# Altium schematic sheet CPLD.SchDoc
size A4; SheetNumber: 5; SheetTotal: 6
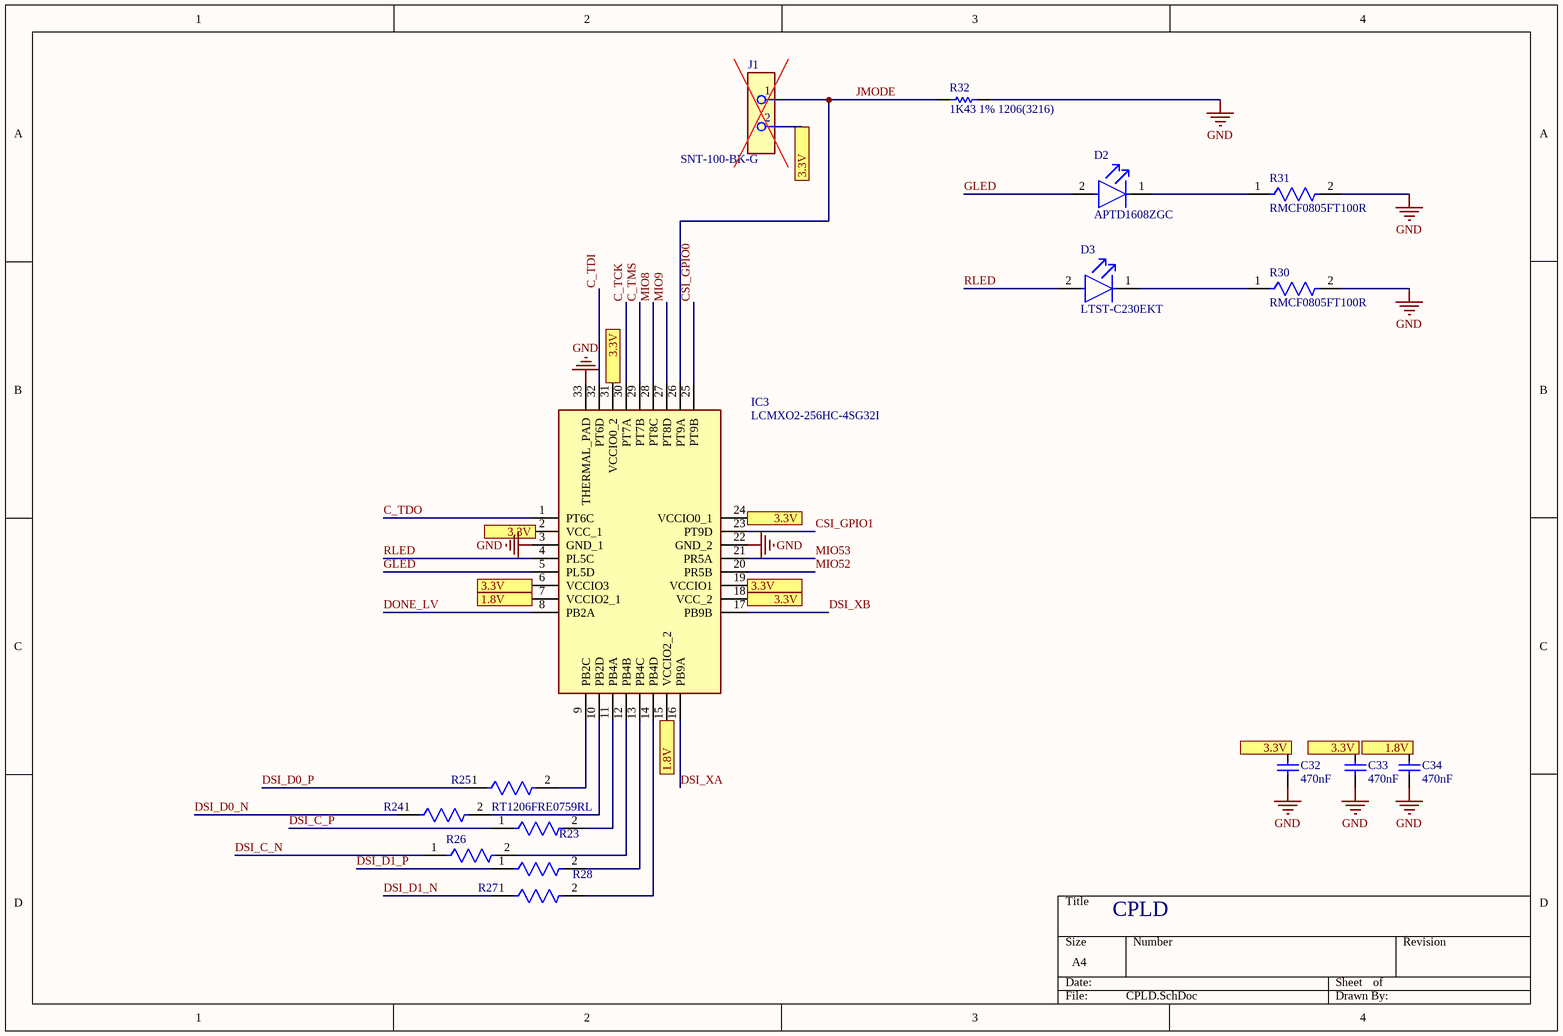
[diagram p0: CPLD.SchDoc]

## Parts
C32  470nF  [CAPC2013X140X50ML20T25]
C33  470nF  [CAPC2013X140X50ML20T25]
C34  470nF  [CAPC2013X140X50ML20T25]
D2  APTD1608ZGC  [FP-APTD1608ZGC-MFG]
D3  LTST-C230EKT  [FP-LTST-C230EKT-MFG]
IC3  LCMXO2-256HC-4SG32I  [QFN50P500X500X60-33N]
J1  SNT-100-BK-G  [FP-SNT-100-BK-G-MFG]  (no BOM)
R23  RT1206FRE0759RL  [FP-RT1206-MFG]  (value not drawn)
R24  RT1206FRE0759RL  [FP-RT1206-MFG]  (value not drawn)
R25  RT1206FRE0759RL  [FP-RT1206-MFG]
R26  RT1206FRE0759RL  [FP-RT1206-MFG]  (value not drawn)
R27  RT1206FRE0759RL  [FP-RT1206-MFG]  (value not drawn)
R28  RT1206FRE0759RL  [FP-RT1206-MFG]  (value not drawn)
R30  RMCF0805FT100R  [FP-RMCF0805-IPC_A]
R31  RMCF0805FT100R  [FP-RMCF0805-IPC_A]
R32  1K43 1% 1206(3216)  [RESC1206(3216)_M]

## Ports
1.8V (see CPLD[2C], CPLD[2D]), 1.8V (see CPLD[2C], CPLD[4C]), 1.8V (see CPLD[2D], CPLD[4C]), 3.3V (see connector1[2A], connector2[1B], connector2[3A], connector2[4A], connector2[4C], connector2[4D], connector2[5C], connector2[6B], connector2[6D], connector2[7B], CPLD[2B], CPLD[2C], CPLD[3A], CPLD[4C], ftdi[1B], ftdi[1C], ftdi[1D], ftdi[2B], ftdi[3C], ftdi[4B]), 3.3V (see connector1[2A], connector2[1B], connector2[3A], connector2[4A], connector2[4C], connector2[4D], connector2[5C], connector2[6B], connector2[6D], connector2[7B], CPLD[2B], CPLD[2C], CPLD[4C], ftdi[1B], ftdi[1C], ftdi[1D], ftdi[2B], ftdi[3C], ftdi[4B]), 3.3V (see connector1[2A], connector2[1B], connector2[3A], connector2[4A], connector2[4C], connector2[4D], connector2[5C], connector2[6B], connector2[6D], connector2[7B], CPLD[2C], CPLD[3A], CPLD[4C], ftdi[1B], ftdi[1C], ftdi[1D], ftdi[2B], ftdi[3C], ftdi[4B])

## Nets
GND: C32.1 C33.1 C34.1 IC3.3(GND_1) IC3.22(GND_2) IC3.33(THERMAL_PAD) R30.2 R31.2 R32.2
1.8V: IC3.7(VCCIO2_1) IC3.15(VCCIO2_2) ; port 1.8V
3.3V: IC3.6(VCCIO3) IC3.18(VCC_2) IC3.19(VCCIO1) IC3.24(VCCIO0_1) IC3.31(VCCIO0_2) ; port 3.3V
C_TCK: IC3.30(PT7A)
C_TDI: IC3.32(PT6D)
C_TDO: IC3.1(PT6C)
C_TMS: IC3.29(PT7B)
CSI_GPIO0: IC3.25(PT9B)
CSI_GPIO1: IC3.23(PT9D)
DONE_LV: IC3.8(PB2A)
DSI_C_N: R26.1
DSI_C_P: R23.1
DSI_D0_N: R24.1
DSI_D0_P: R25.1
DSI_D1_N: R27.1
DSI_D1_P: R28.1
DSI_XA: IC3.16(PB9A)
DSI_XB: IC3.17(PB9B)
GLED: D2.2(A) IC3.5(PL5D)
JMODE: IC3.26(PT9A) R32.1
MIO8: IC3.28(PT8C)
MIO9: IC3.27(PT8D)
MIO52: IC3.20(PR5B)
MIO53: IC3.21(PR5A)
RLED: D3.2(A) IC3.4(PL5C)
NetD2_1: D2.1(C) R31.1
NetD3_1: D3.1(C) R30.1
NetIC3_9: IC3.9(PB2C) R25.2
NetIC3_10: IC3.10(PB2D) R24.2
NetIC3_11: IC3.11(PB4A) R23.2
NetIC3_12: IC3.12(PB4B) R26.2
NetIC3_13: IC3.13(PB4C) R28.2
NetIC3_14: IC3.14(PB4D) R27.2

Not connected (* = marked no-connect by the designer): C32 2; C33 2; C34 2; IC3 2(VCC_1)

## Notes on the sheet
- CPLD

## Library data of the parts
C32-C34 = CMP-2007-04634-1: Manufacturer: AVX Interconnect / Elco; Part Number: 08055C474JAT2A
D2 = CMP-44529-000047-1: LED GREEN CLEAR CHIP SMD; Forward Current: 20mA; Viewing Angle: 60°; Dominant Wavelength: 525nm; Luminous Intensity: 780mcd; Forward Voltage: 3.3V; Lens Style: Clear; Max Operating Temperature: 85°C; Case/Package: 0603; Illumination Color: Green; Mount: Surface Mount; Case Code (Imperial): 0603; Case Code (Metric): 1608; Min Operating Temperature: -40°C; Length: 1.6mm; Color: Green; Lead Free: Lead Free; Width: 0.8mm; Package Quantity: 2000; Height: 0.95mm; Packaging: Tape and Reel; Test Current: 20mA
D3 = CMP-22017-000030-1: LED RED CLEAR CHIP SMD; Forward Current: 30mA; Test Current: 10mA; Number of Elements: 1; Viewing Angle: 130°; Dominant Wavelength: 621nm; Forward Voltage: 2V; Lens Style: Diffused; Power Rating: 100mW; Reverse Voltage: 5V; Wavelength: 630nm; Luminous Intensity: 6mcd; Lens Color: Colorless; Case/Package: 1206; Case Code (Imperial): 1206; Package Quantity: 1; Lead Free: Lead Free; Case Code (Metric): 3216; Height: 1.1mm; Lens Transparency: Clear; Mount: Surface Mount; Depth: 1.6mm; Number of LEDs: 1; Power Dissipation: 100mW; Max Operating Temperature: 85°C; Width: 1.6mm; Color: Red; Number of Pins: 2; Min Operating Temperature: -55°C; Packaging: Tape and Reel; Radiation Hardening: No; Illumination Color: Red; Length: 3.2mm
IC3 = LCMXO2-256HC-4SG32I: Integrated Circuit; Manufacturer_Name: Lattice Semiconductor; Datasheet Link: https://datasheet.datasheetarchive.com/originals/distributors/Datasheets-DGA19/41708.pdf; Height: 0.6mm; Manufacturer_Part_Number: LCMXO2-256HC-4SG32I; Mouser Part Number: 842-LCXO2256HC4SG32I; Mouser Price/Stock: https://www.mouser.co.uk/ProductDetail/Lattice/LCMXO2-256HC-4SG32I?qs=0pXo3msJWLP4CWqvg3QOuw%3D%3D; Arrow Part Number: LCMXO2-256HC-4SG32I; Arrow Price/Stock: https://www.arrow.com/en/products/lcmxo2-256hc-4sg32i/lattice-semiconductor?region=nac
J1 = CMP-02752-000005-1: CONN SHUNT 2POS; Number of Positions: 2; Max Current Rating: 2.5A; Pitch: 2.54mm; Contact Resistance: 5mR; Min Operating Temperature: -55°C; Number of Rows: 1; Housing Color: Black; Package Quantity: 1; Depth: 2.54mm; Housing Material: Polyester; Series: SNT; RoHS Compliant: Yes; Orientation: Straight; Radiation Hardening: No; Number of Contacts: 2; REACH SVHC: No SVHC; Length: 5.08mm; Contact Plating: Gold; Max Operating Temperature: 125°C; Color: Black; Packaging: Bulk; Height: 0.24inch; Contact Material: Bronze
R23-R28 = CMP-03412-008110-1: RES SMD 59 OHM 1% 1/4W 1206; Manufacturer: Yageo; Power Rating: 0.25W; Voltage Rating: 200V; Temperature Coefficient: 50 ppm/°C; Value: 59Ω; Tolerance: 0.0002; Temperature Range High: +155°C; Automotive: No; Octopart: https://octopart.com/rt1206fre0759rl-yageo-1483639; Temperature Range Low: -55°C; Manufacturer Part Number: RT1206FRE0759RL; Package: RT1206; Device Class L2: Resistors; Device Class L1: Passive Components; Footprint Url: http://www.yageo.com/exep/pages/download/literatures/PYu-R_Mount_10.pdf; Category: Res; Mouser Description: Thin Film Resistors 1/4W 59 ohm 1% 50ppm; Height: 0.65mm; Digikey Description: RES SMD 59 OHM 1% 1/4W 1206; Series: RT; ComponentLink2Description: Datasheet; Composition: Thin Film; Temperature: -55°C to +155°C; Lead Free: Yes; Ipc Land Pattern Name: RESC310160X55; ComponentLink2URL: http://www.yageo.com/documents/recent/PYu-RT_1-to-0.01_RoHS_L_9.pdf; RoHS: TRUE; Resistance: 59Ω; Device Class L3: Chip SMD Resistors
R30 R31 = CMP-26527-001731-1: 100Ω ±1% 0.125W 0805 Thick Film Chip Resistor AEC-Q200 compliant; Power Rating: 250mW; Temperature Coefficient: 100ppm/°C; Resistance: 100R; Max Power Dissipation: 125mW; Radiation Hardening: No; RoHS Compliant: Yes; Case Code (Imperial): 0805; Depth: 1.25mm; Length: 2mm; Min Operating Temperature: -55°C; Series: RMCF; Packaging: Tape and Reel; Features: Automotive AEC-Q200; Height: 0.026inch; Size Code: 0805; Tolerance: 1%; Number of Terminations: 2; Max Operating Temperature: 155°C; Case/Package: 0805; Width: 0.049inch; Contact Plating: Tin; Resistor Type: Thick Film; Construction: Rectangular; Lead Free: Lead Free; Military Standard: Not; Case Code (Metric): 2012; Mount: Surface Mount
R32 = CMP-1014-00526-1: 1K43 0.25W 1% 1206 (3216 Metric)  SMD; Value: 1430.00 Ohm; Case-EIA: 1206; Case-Metric: 3216; Power: 0.25 W; Technology: SMT; Tolerance: 1 %